# Altium schematic sheet STM32F7.SchDoc
size 840 x 594 mm; SheetNumber: 2; SheetTotal: 6; ListNumber: 2
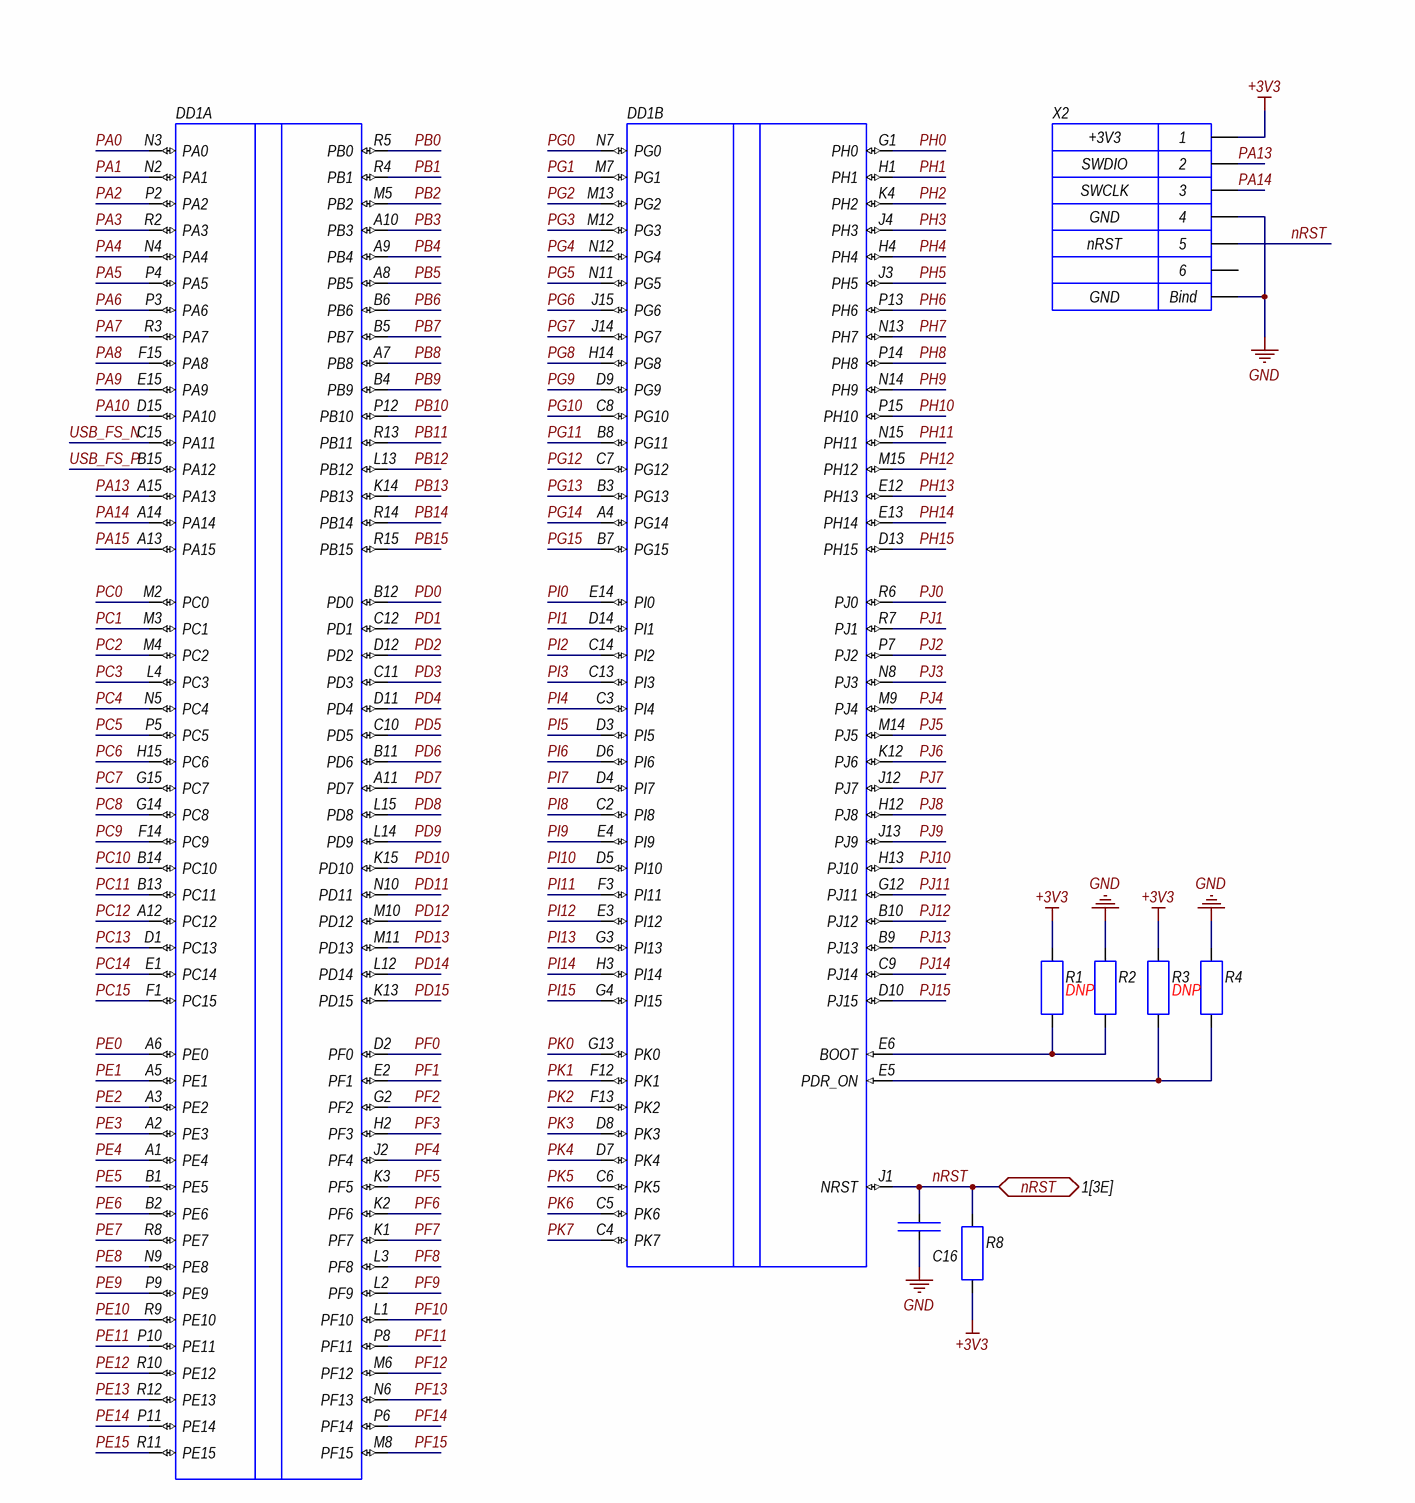
[diagram p0: STM32F7.SchDoc, top left]
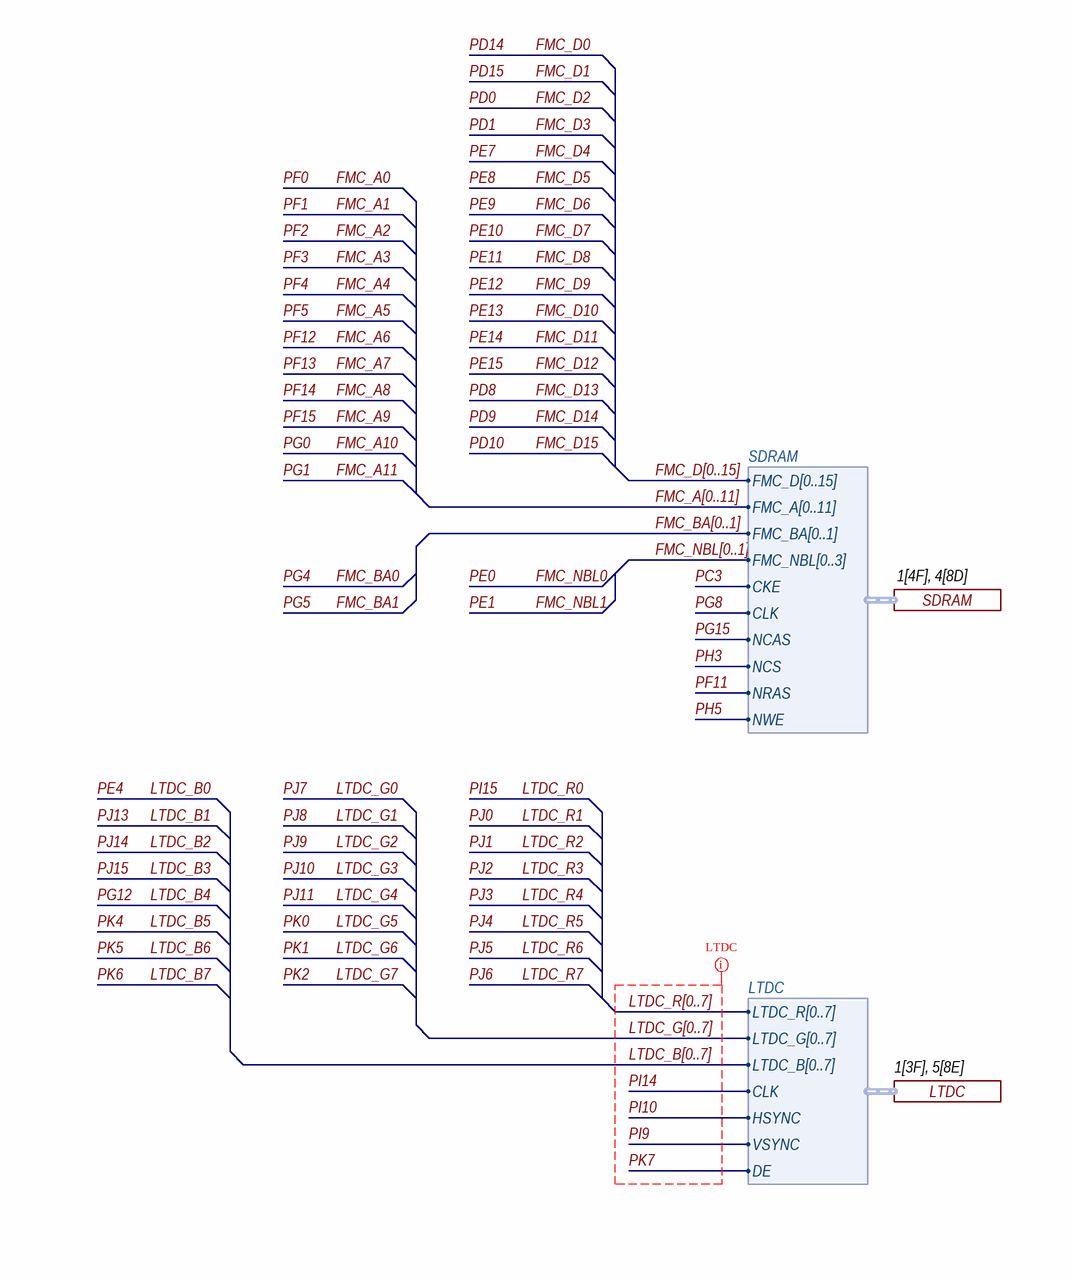
[diagram p1: STM32F7.SchDoc, top right]
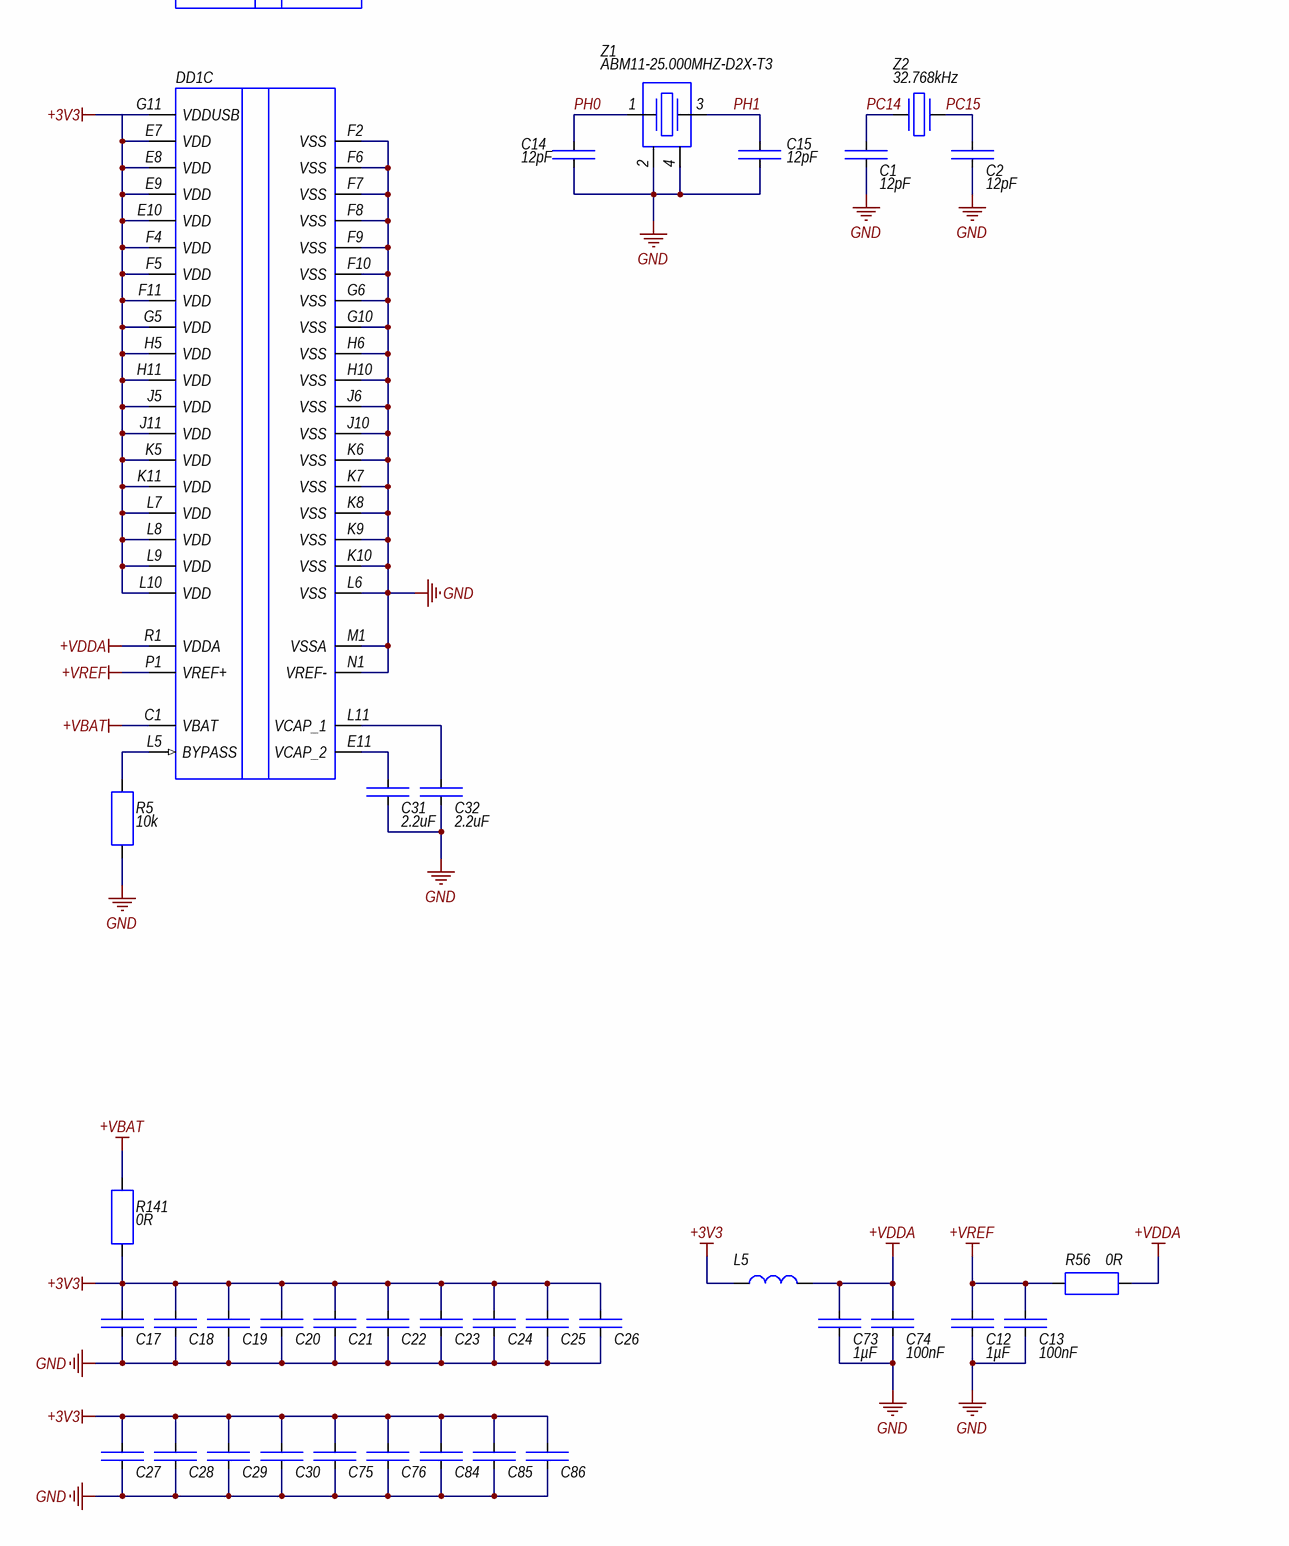
[diagram p2: STM32F7.SchDoc, bottom left]
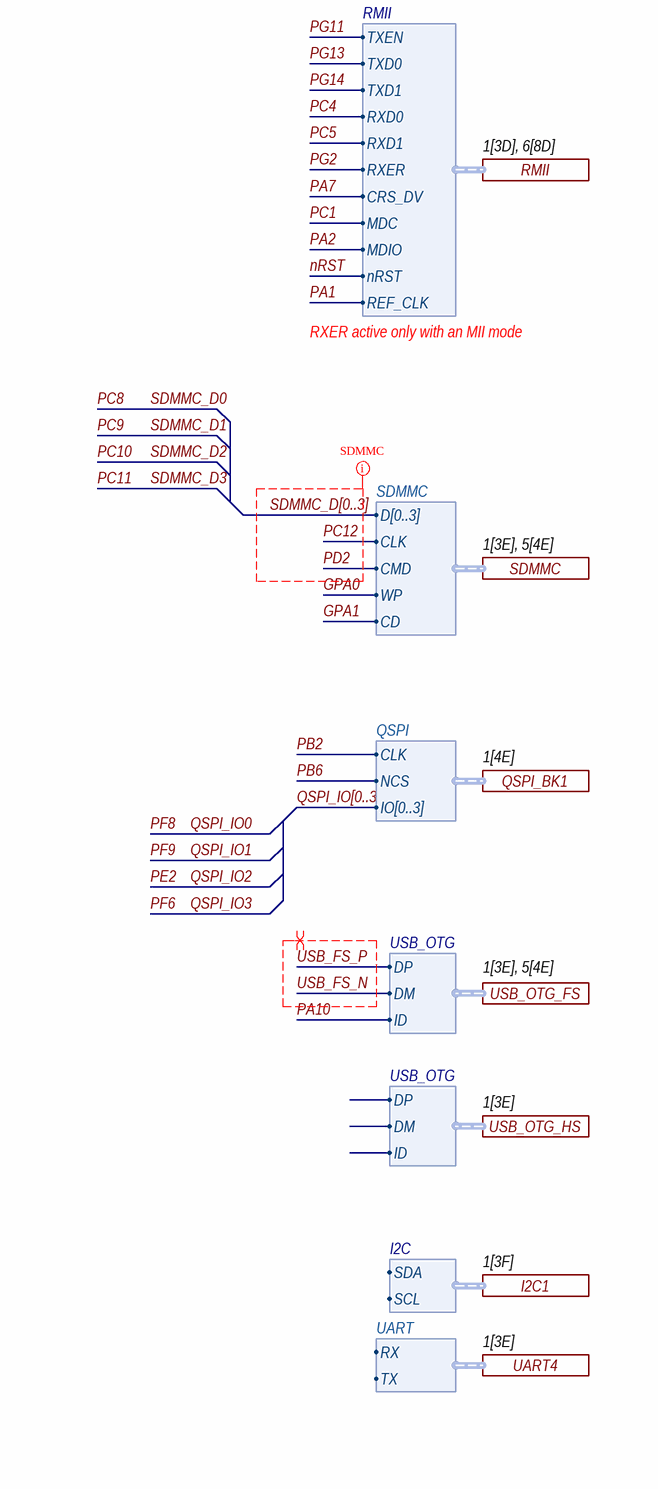
[diagram p3: STM32F7.SchDoc, bottom right]

## Parts
C1  Capacitance: 12pF  [Capacitor 0402]  (hidden comment: Конденсатор керам. ЧИП NP0, 5%, 0402, 12 пФ)
C2  Capacitance: 12pF  [Capacitor 0402]  (hidden comment: Конденсатор керам. ЧИП NP0, 5%, 0402, 12 пФ)
C12  Capacitance: 1µF  [Capacitor 0603]  (hidden comment: Конденсатор керам. ЧИП X5R, 10%, 0603, 1 мкФ)
C13  Capacitance: 100nF  [Capacitor 0603]  (hidden comment: Конденсатор керам. ЧИП X7R, 10%, 0603, 0.1 мкФ)
C14  Capacitance: 12pF  [Capacitor 0402]  (hidden comment: Конденсатор керам. ЧИП NP0, 5%, 0402, 12 пФ)
C15  Capacitance: 12pF  [Capacitor 0402]  (hidden comment: Конденсатор керам. ЧИП NP0, 5%, 0402, 12 пФ)
C16  Конденсатор керам. ЧИП X5R, 10%, 0402, 0.1 мкФ  [Capacitor 0402]  (value not drawn)
C17  Конденсатор керам. ЧИП X5R, 10%, 0402, 0.1 мкФ  [Capacitor 0402]  (value not drawn)
C18  Конденсатор керам. ЧИП X5R, 10%, 0402, 0.1 мкФ  [Capacitor 0402]  (value not drawn)
C19  Конденсатор керам. ЧИП X5R, 10%, 0402, 0.1 мкФ  [Capacitor 0402]  (value not drawn)
C20  Конденсатор керам. ЧИП X5R, 10%, 0402, 0.1 мкФ  [Capacitor 0402]  (value not drawn)
C21  Конденсатор керам. ЧИП X5R, 10%, 0402, 0.1 мкФ  [Capacitor 0402]  (value not drawn)
C22  Конденсатор керам. ЧИП X5R, 10%, 0402, 0.1 мкФ  [Capacitor 0402]  (value not drawn)
C23  Конденсатор керам. ЧИП X5R, 10%, 0402, 0.1 мкФ  [Capacitor 0402]  (value not drawn)
C24  Конденсатор керам. ЧИП X5R, 10%, 0402, 0.1 мкФ  [Capacitor 0402]  (value not drawn)
C25  Конденсатор керам. ЧИП X5R, 10%, 0402, 0.1 мкФ  [Capacitor 0402]  (value not drawn)
C26  Конденсатор керам. ЧИП X5R, 10%, 0402, 0.1 мкФ  [Capacitor 0402]  (value not drawn)
C27  Конденсатор керам. ЧИП X5R, 10%, 0402, 0.1 мкФ  [Capacitor 0402]  (value not drawn)
C28  Конденсатор керам. ЧИП X5R, 10%, 0402, 0.1 мкФ  [Capacitor 0402]  (value not drawn)
C29  Конденсатор керам. ЧИП X5R, 10%, 0402, 0.1 мкФ  [Capacitor 0402]  (value not drawn)
C30  Конденсатор керам. ЧИП X5R, 10%, 0402, 0.1 мкФ  [Capacitor 0402]  (value not drawn)
C31  Capacitance: 2.2uF  [SMD_1206]  (hidden comment: NCap)
C32  Capacitance: 2.2uF  [SMD_1206]  (hidden comment: NCap)
C73  Capacitance: 1µF  [Capacitor 0603]  (hidden comment: Конденсатор керам. ЧИП X5R, 10%, 0603, 1 мкФ)
C74  Capacitance: 100nF  [Capacitor 0603]  (hidden comment: Конденсатор керам. ЧИП X7R, 10%, 0603, 0.1 мкФ)
C75  Конденсатор керам. ЧИП X5R, 10%, 0402, 0.1 мкФ  [Capacitor 0402]  (value not drawn)
C76  Конденсатор керам. ЧИП X5R, 10%, 0402, 0.1 мкФ  [Capacitor 0402]  (value not drawn)
C84  Конденсатор керам. ЧИП X5R, 10%, 0402, 0.1 мкФ  [Capacitor 0402]  (value not drawn)
C85  Конденсатор керам. ЧИП X5R, 10%, 0402, 0.1 мкФ  [Capacitor 0402]  (value not drawn)
C86  Конденсатор керам. ЧИП X5R, 10%, 0402, 0.1 мкФ  [Capacitor 0402]  (value not drawn)
DD1  Микросхема STM32F746NGH6  [STM-TFBGA216]  (value not drawn)  (parts A,B,C of 3)
L5  Дроссель BLM18HE152SN1D  [BLM18HE152SN1D]  (value not drawn)
R1  (no value)  [SMD_0402]
R2  (no value)  [SMD_0402]
R3  (no value)  [SMD_0402]
R4  (no value)  [SMD_0402]
R5  Resistance: 10k  [SMD_0402]
R8  (no value)  [SMD_0402]
R56  Device: 0R  [SMD_0402]  (hidden comment: Resistor)
R141  Resistance: 0R  [SMD_0402]
X2  Вилка DF13C-6P-1.25V(50)  [DF13C-6P-1.25V(50)]  (value not drawn)
Z1  Manufacturer Part Number: ABM11-25.000MHZ-D2X-T3  [ABM11-MFG]  (hidden comment: Резонатор ABM11-25.000MHZ-D2X-T3)
Z2  Резонатор NX3215SA 32.768 кГц  [FP-NX3215SA-MFG]  (value not drawn)

## Ports
I2C1 (harness I2C, see 1[3F]), LTDC (harness LTDC, see 1[3F], 5[8E]), nRST (bidir, see 1[3E]), QSPI_BK1 (harness QSPI, see 1[4E]), RMII (harness RMII, see 1[3D], 6[8D]), SDMMC (harness SDMMC, see 1[3E], 5[4E]), SDRAM (harness SDRAM, see 1[4F], 4[8D]), UART4 (harness UART, see 1[3E]), USB_OTG_FS (harness USB_OTG, see 1[3E], 5[4E]), USB_OTG_HS (harness USB_OTG, see 1[3E])

## Harnesses
SDRAM: FMC_A[0..11], FMC_BA[0..1], CKE, CLK, FMC_D[0..15], FMC_NBL[0..3], NCAS, NCS, NRAS, NWE
LTDC: CLK, DE, HSYNC, LTDC_B[0..7], LTDC_G[0..7], LTDC_R[0..7], VSYNC
QSPI: CLK, NCS, IO[0..3]
UART: RX, TX
SDMMC: CD, CLK, CMD, D[0..3], WP
USB_OTG: DP, DM, ID
I2C: SDA, SCL
RMII: TXEN, TXD0, RXD0, RXD1, CRS_DV, RXER, MDC, MDIO, nRST, REF_CLK, TXD1

## Nets
+3V3: C17.1 C18.1 C19.1 C20.1 C21.1 C22.1 C23.1 C24.1 C25.1 C26.1 C27.1 C28.1 C29.1 C30.1 C75.1 C76.1 C84.1 C85.1 C86.1 DD1.E7(VDD) DD1.E8(VDD) DD1.E9(VDD) DD1.E10(VDD) DD1.F4(VDD) DD1.F5(VDD) DD1.F11(VDD) DD1.G5(VDD) DD1.G11(VDDUSB) DD1.H5(VDD) DD1.H11(VDD) DD1.J5(VDD) DD1.J11(VDD) DD1.K5(VDD) DD1.K11(VDD) DD1.L7(VDD) DD1.L8(VDD) DD1.L9(VDD) DD1.L10(VDD) L5.1 R1.2 R3.2 R8.1 R141.1 X2.1
+VBAT: DD1.C1(VBAT) R141.2
+VDDA: C73.1 C74.1 DD1.R1(VDDA) L5.2 R56.2
+VREF: C12.1 C13.1 DD1.P1(VREF+) R56.1
GND: C1.2 C2.2 C12.2 C13.2 C14.2 C15.2 C16.2 C17.2 C18.2 C19.2 C20.2 C21.2 C22.2 C23.2 C24.2 C25.2 C26.2 C27.2 C28.2 C29.2 C30.2 C31.2 C32.2 C73.2 C74.2 C75.2 C76.2 C84.2 C85.2 C86.2 DD1.F2(VSS) DD1.F6(VSS) DD1.F7(VSS) DD1.F8(VSS) DD1.F9(VSS) DD1.F10(VSS) DD1.G6(VSS) DD1.G10(VSS) DD1.H6(VSS) DD1.H10(VSS) DD1.J6(VSS) DD1.J10(VSS) DD1.K6(VSS) DD1.K7(VSS) DD1.K8(VSS) DD1.K9(VSS) DD1.K10(VSS) DD1.L6(VSS) DD1.M1(VSSA) DD1.N1(VREF-) R2.2 R4.2 R5.1 X2.0(Bind) X2.4 Z1.2 Z1.4
FMC_A0: DD1.D2(PF0)  [also labelled PF0]
FMC_A1: DD1.E2(PF1)  [also labelled PF1]
FMC_A2: DD1.G2(PF2)  [also labelled PF2]
FMC_A3: DD1.H2(PF3)  [also labelled PF3]
FMC_A4: DD1.J2(PF4)  [also labelled PF4]
FMC_A5: DD1.K3(PF5)  [also labelled PF5]
FMC_A6: DD1.M6(PF12)  [also labelled PF12]
FMC_A7: DD1.N6(PF13)  [also labelled PF13]
FMC_A8: DD1.P6(PF14)  [also labelled PF14]
FMC_A9: DD1.M8(PF15)  [also labelled PF15]
FMC_A10: DD1.N7(PG0)  [also labelled PG0]
FMC_A11: DD1.M7(PG1)  [also labelled PG1]
FMC_BA0: DD1.N12(PG4)  [also labelled PG4]
FMC_BA1: DD1.N11(PG5)  [also labelled PG5]
FMC_D0: DD1.L12(PD14)  [also labelled PD14]
FMC_D1: DD1.K13(PD15)  [also labelled PD15]
FMC_D2: DD1.B12(PD0)  [also labelled PD0]
FMC_D3: DD1.C12(PD1)  [also labelled PD1]
FMC_D4: DD1.R8(PE7)  [also labelled PE7]
FMC_D5: DD1.N9(PE8)  [also labelled PE8]
FMC_D6: DD1.P9(PE9)  [also labelled PE9]
FMC_D7: DD1.R9(PE10)  [also labelled PE10]
FMC_D8: DD1.P10(PE11)  [also labelled PE11]
FMC_D9: DD1.R10(PE12)  [also labelled PE12]
FMC_D10: DD1.R12(PE13)  [also labelled PE13]
FMC_D11: DD1.P11(PE14)  [also labelled PE14]
FMC_D12: DD1.R11(PE15)  [also labelled PE15]
FMC_D13: DD1.L15(PD8)  [also labelled PD8]
FMC_D14: DD1.L14(PD9)  [also labelled PD9]
FMC_D15: DD1.K15(PD10)  [also labelled PD10]
FMC_NBL0: DD1.A6(PE0)  [also labelled PE0]
FMC_NBL1: DD1.A5(PE1)  [also labelled PE1]
GPA0: port SDMMC.WP
GPA1: port SDMMC.CD
LTDC_B0: DD1.A1(PE4)  [also labelled PE4]
LTDC_B1: DD1.B9(PJ13)  [also labelled PJ13]
LTDC_B2: DD1.C9(PJ14)  [also labelled PJ14]
LTDC_B3: DD1.D10(PJ15)  [also labelled PJ15]
LTDC_B4: DD1.C7(PG12)  [also labelled PG12]
LTDC_B5: DD1.D7(PK4)  [also labelled PK4]
LTDC_B6: DD1.C6(PK5)  [also labelled PK5]
LTDC_B7: DD1.C5(PK6)  [also labelled PK6]
LTDC_G0: DD1.J12(PJ7)  [also labelled PJ7]
LTDC_G1: DD1.H12(PJ8)  [also labelled PJ8]
LTDC_G2: DD1.J13(PJ9)  [also labelled PJ9]
LTDC_G3: DD1.H13(PJ10)  [also labelled PJ10]
LTDC_G4: DD1.G12(PJ11)  [also labelled PJ11]
LTDC_G5: DD1.G13(PK0)  [also labelled PK0]
LTDC_G6: DD1.F12(PK1)  [also labelled PK1]
LTDC_G7: DD1.F13(PK2)  [also labelled PK2]
LTDC_R0: DD1.G4(PI15)  [also labelled PI15]
LTDC_R1: DD1.R6(PJ0)  [also labelled PJ0]
LTDC_R2: DD1.R7(PJ1)  [also labelled PJ1]
LTDC_R3: DD1.P7(PJ2)  [also labelled PJ2]
LTDC_R4: DD1.N8(PJ3)  [also labelled PJ3]
LTDC_R5: DD1.M9(PJ4)  [also labelled PJ4]
LTDC_R6: DD1.M14(PJ5)  [also labelled PJ5]
LTDC_R7: DD1.K12(PJ6)  [also labelled PJ6]
nRST: C16.1 DD1.J1(NRST) R8.2 X2.5 ; port nRST, port RMII.nRST
PA0: DD1.N3(PA0)
PA1: DD1.N2(PA1) ; port RMII.REF_CLK
PA2: DD1.P2(PA2) ; port RMII.MDIO
PA3: DD1.R2(PA3)
PA4: DD1.N4(PA4)
PA5: DD1.P4(PA5)
PA6: DD1.P3(PA6)
PA7: DD1.R3(PA7) ; port RMII.CRS_DV
PA8: DD1.F15(PA8)
PA9: DD1.E15(PA9)
PA10: DD1.D15(PA10) ; port USB_OTG_FS.ID
PA13: DD1.A15(PA13) X2.2
PA14: DD1.A14(PA14) X2.3
PA15: DD1.A13(PA15)
PB0: DD1.R5(PB0)
PB1: DD1.R4(PB1)
PB2: DD1.M5(PB2) ; port QSPI_BK1.CLK
PB3: DD1.A10(PB3)
PB4: DD1.A9(PB4)
PB5: DD1.A8(PB5)
PB6: DD1.B6(PB6) ; port QSPI_BK1.NCS
PB7: DD1.B5(PB7)
PB8: DD1.A7(PB8)
PB9: DD1.B4(PB9)
PB10: DD1.P12(PB10)
PB11: DD1.R13(PB11)
PB12: DD1.L13(PB12)
PB13: DD1.K14(PB13)
PB14: DD1.R14(PB14)
PB15: DD1.R15(PB15)
PC0: DD1.M2(PC0)
PC1: DD1.M3(PC1) ; port RMII.MDC
PC2: DD1.M4(PC2)
PC3: DD1.L4(PC3) ; port SDRAM.CKE
PC4: DD1.N5(PC4) ; port RMII.RXD0
PC5: DD1.P5(PC5) ; port RMII.RXD1
PC6: DD1.H15(PC6)
PC7: DD1.G15(PC7)
PC8: DD1.G14(PC8)  [also labelled SDMMC_D0]
PC9: DD1.F14(PC9)  [also labelled SDMMC_D1]
PC10: DD1.B14(PC10)  [also labelled SDMMC_D2]
PC11: DD1.B13(PC11)  [also labelled SDMMC_D3]
PC12: DD1.A12(PC12) ; port SDMMC.CLK
PC13: DD1.D1(PC13)
PC14: C1.1 DD1.E1(PC14) Z2.1
PC15: C2.1 DD1.F1(PC15) Z2.2
PD2: DD1.D12(PD2) ; port SDMMC.CMD
PD3: DD1.C11(PD3)
PD4: DD1.D11(PD4)
PD5: DD1.C10(PD5)
PD6: DD1.B11(PD6)
PD7: DD1.A11(PD7)
PD11: DD1.N10(PD11)
PD12: DD1.M10(PD12)
PD13: DD1.M11(PD13)
PE2: DD1.A3(PE2)  [also labelled QSPI_IO2]
PE3: DD1.A2(PE3)
PE5: DD1.B1(PE5)
PE6: DD1.B2(PE6)
PF6: DD1.K2(PF6)  [also labelled QSPI_IO3]
PF7: DD1.K1(PF7)
PF8: DD1.L3(PF8)  [also labelled QSPI_IO0]
PF9: DD1.L2(PF9)  [also labelled QSPI_IO1]
PF10: DD1.L1(PF10)
PF11: DD1.P8(PF11) ; port SDRAM.NRAS
PG2: DD1.M13(PG2) ; port RMII.RXER
PG3: DD1.M12(PG3)
PG6: DD1.J15(PG6)
PG7: DD1.J14(PG7)
PG8: DD1.H14(PG8) ; port SDRAM.CLK
PG9: DD1.D9(PG9)
PG10: DD1.C8(PG10)
PG11: DD1.B8(PG11) ; port RMII.TXEN
PG13: DD1.B3(PG13) ; port RMII.TXD0
PG14: DD1.A4(PG14) ; port RMII.TXD1
PG15: DD1.B7(PG15) ; port SDRAM.NCAS
PH0: C14.1 DD1.G1(PH0) Z1.1
PH1: C15.1 DD1.H1(PH1) Z1.3
PH2: DD1.K4(PH2)
PH3: DD1.J4(PH3) ; port SDRAM.NCS
PH4: DD1.H4(PH4)
PH5: DD1.J3(PH5) ; port SDRAM.NWE
PH6: DD1.P13(PH6)
PH7: DD1.N13(PH7)
PH8: DD1.P14(PH8)
PH9: DD1.N14(PH9)
PH10: DD1.P15(PH10)
PH11: DD1.N15(PH11)
PH12: DD1.M15(PH12)
PH13: DD1.E12(PH13)
PH14: DD1.E13(PH14)
PH15: DD1.D13(PH15)
PI0: DD1.E14(PI0)
PI1: DD1.D14(PI1)
PI2: DD1.C14(PI2)
PI3: DD1.C13(PI3)
PI4: DD1.C3(PI4)
PI5: DD1.D3(PI5)
PI6: DD1.D6(PI6)
PI7: DD1.D4(PI7)
PI8: DD1.C2(PI8)
PI9: DD1.E4(PI9) ; port LTDC.VSYNC
PI10: DD1.D5(PI10) ; port LTDC.HSYNC
PI11: DD1.F3(PI11)
PI12: DD1.E3(PI12)
PI13: DD1.G3(PI13)
PI14: DD1.H3(PI14) ; port LTDC.CLK
PJ12: DD1.B10(PJ12)
PK3: DD1.D8(PK3)
PK7: DD1.C4(PK7) ; port LTDC.DE
USB_FS_N: DD1.C15(PA11) ; port USB_OTG_FS.DM
USB_FS_P: DD1.B15(PA12) ; port USB_OTG_FS.DP
NetC31_1: C31.1 DD1.E11(VCAP_2)
NetC32_1: C32.1 DD1.L11(VCAP_1)
NetDD1_E5: DD1.E5(PDR_ON) R3.1 R4.1
NetDD1_E6: DD1.E6(BOOT) R1.1 R2.1
NetDD1_L5: DD1.L5(BYPASS) R5.2

Not connected (* = marked no-connect by the designer): X2 6

## Buses and harness runs
bus FMC_A[0..11]
bus FMC_BA[0..1]
bus FMC_D[0..15]
bus FMC_NBL[0..1]
bus LTDC_B[0..7]
bus LTDC_G[0..7]
bus LTDC_R[0..7]
bus QSPI_IO[0..3]
bus SDMMC_D[0..3]

## Layout directives
net class RGB888: LTDC_B[0..7], LTDC_G[0..7], LTDC_R[0..7], PI9, PI10, PI14, PK7
net class SDMMC: PC12, PD2, SDMMC_D[0..3]
differential pair: USB_FS_N, USB_FS_P

## Notes on the sheet
- SWDIO
- +3V3
- SWCLK
- GND
- nRST
- DNP
- RXER active only with an MII mode
- Подп. и дата
- Инв. № дубл.
- Взам. инв. №
- Инв. № подл.
- Изм.
- Лист
- № докум.
- Подп.
- Дата
- Копировал
- Формат А1

## Library data of the parts
C1 C2 C14 C15 = 000818-5: Cap Ceramic 12pF 50V C0G 2% Pad SMD 0402 125C Automotive T/R; Manufacturer: Murata Manufacturing; Manufacturer Part Number: GCM1555C1H120GA16D; Info: 12pFx50V; PCAD Reader Code: 0; Device: 12pF; Voltage: 50V; Case: 0402; Pin Count: 2; Help URL: https://www.digikey.com/en/products/detail/murata-electronics/GCM1555C1H120GA16D/11618605; Storage Code: 0; Dielectric: C0G; Tolerance: 2%
C12 C73 = 000825-4: Multilayer Ceramic Capacitors MLCC - SMD/SMT 0603 50V 1.0uF X5R 10%; Manufacturer: Murata Electronics; Manufacturer Part Number: GRT188R61H105KE13D; Device: 1µFx50V; PCAD Reader Code: 0; Info: 1µFx50V; Voltage: 50V; Case: 0603; Pin Count: 2; Help URL: https://www.digikey.com/en/products/detail/murata-electronics/GRT188R61H105KE13D/5416752; Storage Code: 0; Dielectric: X5R; Tolerance: 10%
C13 C74 = 000129-5: Manufacturer: Yageo; Manufacturer Part Number: CC0603KPX7R9BB104; Device: 0.1uFx50V; Info: 100nFx50V; Voltage: 50V; PCAD Reader Code: 6100; Case: 0603; Pin Count: 2; Storage Code: 626; Dielectric: X7R
C16-C30 C75 C76 C84-C86 = 000821-3: Cap Ceramic 0.1uF 50V X5R 10% Pad SMD 0402 85C T/R; Manufacturer: Murata Manufacturing; Manufacturer Part Number: GRM155R61H104KE14J; Device: 100nFx50V; Capacitance: 100nF; PCAD Reader Code: 0; Info: 100nFx50V; Voltage: 50V; Case: 0402; Pin Count: 2; Help URL: https://www.digikey.com/en/products/detail/murata-electronics/GRM155R61H104KE14J/4905153; Storage Code: 0; Dielectric: X5R; Tolerance: 10%
C31 C32 = Capacitor_1206: Device: 2.2uF; Info: 2.2uF; Part Number: Capacitor_1206
DD1 = STM32F746NGH6: ARM-Based Cortex-M7 32 Bit MCU+FPU, 462 DMIPS, 1024 kB Flash, 320 kB RAM, 168 I/Os, -40 to 85 degC, 216-Pin TFBGA, Halogen-Free, Tray; Manufacturer: STMicroelectronics; Part Number: STM32F746NGH6; Device: STM32F746NGH6; Info: STM32F746NGH6; Case: TFBGA-216; Manufacturer Part Number: STM32F746NGH6; Pin Count: 216
L5 = 000485-3: Ferrite bead; Manufacturer: Murata Electronics; PCAD Reader Code: 7562; Storage Code: 907; Manufacturer Part Number: BLM18HE152SN1D; Help URL: http://www.farnell.com/datasheets/1851896.pdf; Info: BLM18HE152SN1D; Case: BLM18HE152SN1D; Device: BLM18HE152SN1D; Pin Count: 2
R1-R5 R8 R56 R141 = Resistor_0402: Part Number: Resistor_0402; Pin Count: 2
  R5: Device: 10k; Info: 10k
  R56: Info: 0R; Resistance: 0R
  R141: Device: 0R; Info: 0R
X2 = 000336-3: PCAD Reader Code: 4403; Storage Code: 1360; Manufacturer Part Number: DF13C-6P-1.25V(50); Help URL: https://datasheet.octopart.com/DF13C-6P-1.25V%2850%29-Hirose-datasheet-2725.pdf; Info: DF13C-6P-1.25V(50); Case: https://www.snapeda.com/parts/DF13C-6P-1.25V%2850%29/Hirose%20Electric/view-part/?ref=search&t=DF13C-6P-1.25V(50); Device: DF13C-6P-1.25V(50); Pin Count: 6; Mounting: SMD
Z1 = 000855-2: Crystal 25MHz ±20ppm (Tol) ±20ppm (Stability) 10pF FUND 100Ohm 4-Pin Ultra Mini-CSMD T/R; Manufacturer: Abracon; PCAD Reader Code: 0; Shunt Capacitance: 7pF; Temperature Tolerance: 50ppm; Storage Code: 0; Help URL: https://www.farnell.com/datasheets/1936770.pdf; Info: ABM11-25.000MHZ-D2X-T3; Device: 25MHz; Frequency: 25MHz; Pin Count: 4; Frequency Tolerance: 20ppm; Load Capacitance: 10pF
Z2 = 000601-3: 32.768kHz; Manufacturer: NDK; Manufacturer Part Number: NX3215SA-32.768K-STD-MUA-8; PCAD Reader Code: 10090; Storage Code: 19559; Help URL: https://www.compel.ru/infosheet/NDK/NX3215SA-32.768K-STD-MUA-8; Info: 32.768kHz; Case: 3215; Device: 32.768kHz; Frequency: 32.768kHz; Pin Count: 2